# EasyEDA Pro project AceNRFLSMRelease.epro

# Schematic Schematic1_1
Board Name: Board1; Create Date: 2026-01-09; Page Name: P1; Project Name: AceNRFLSM; Schematic Name: Schematic1; Update Date: 2026-01-09; Company: EasyEDA.com; Page Size: A4; Version: V1.0
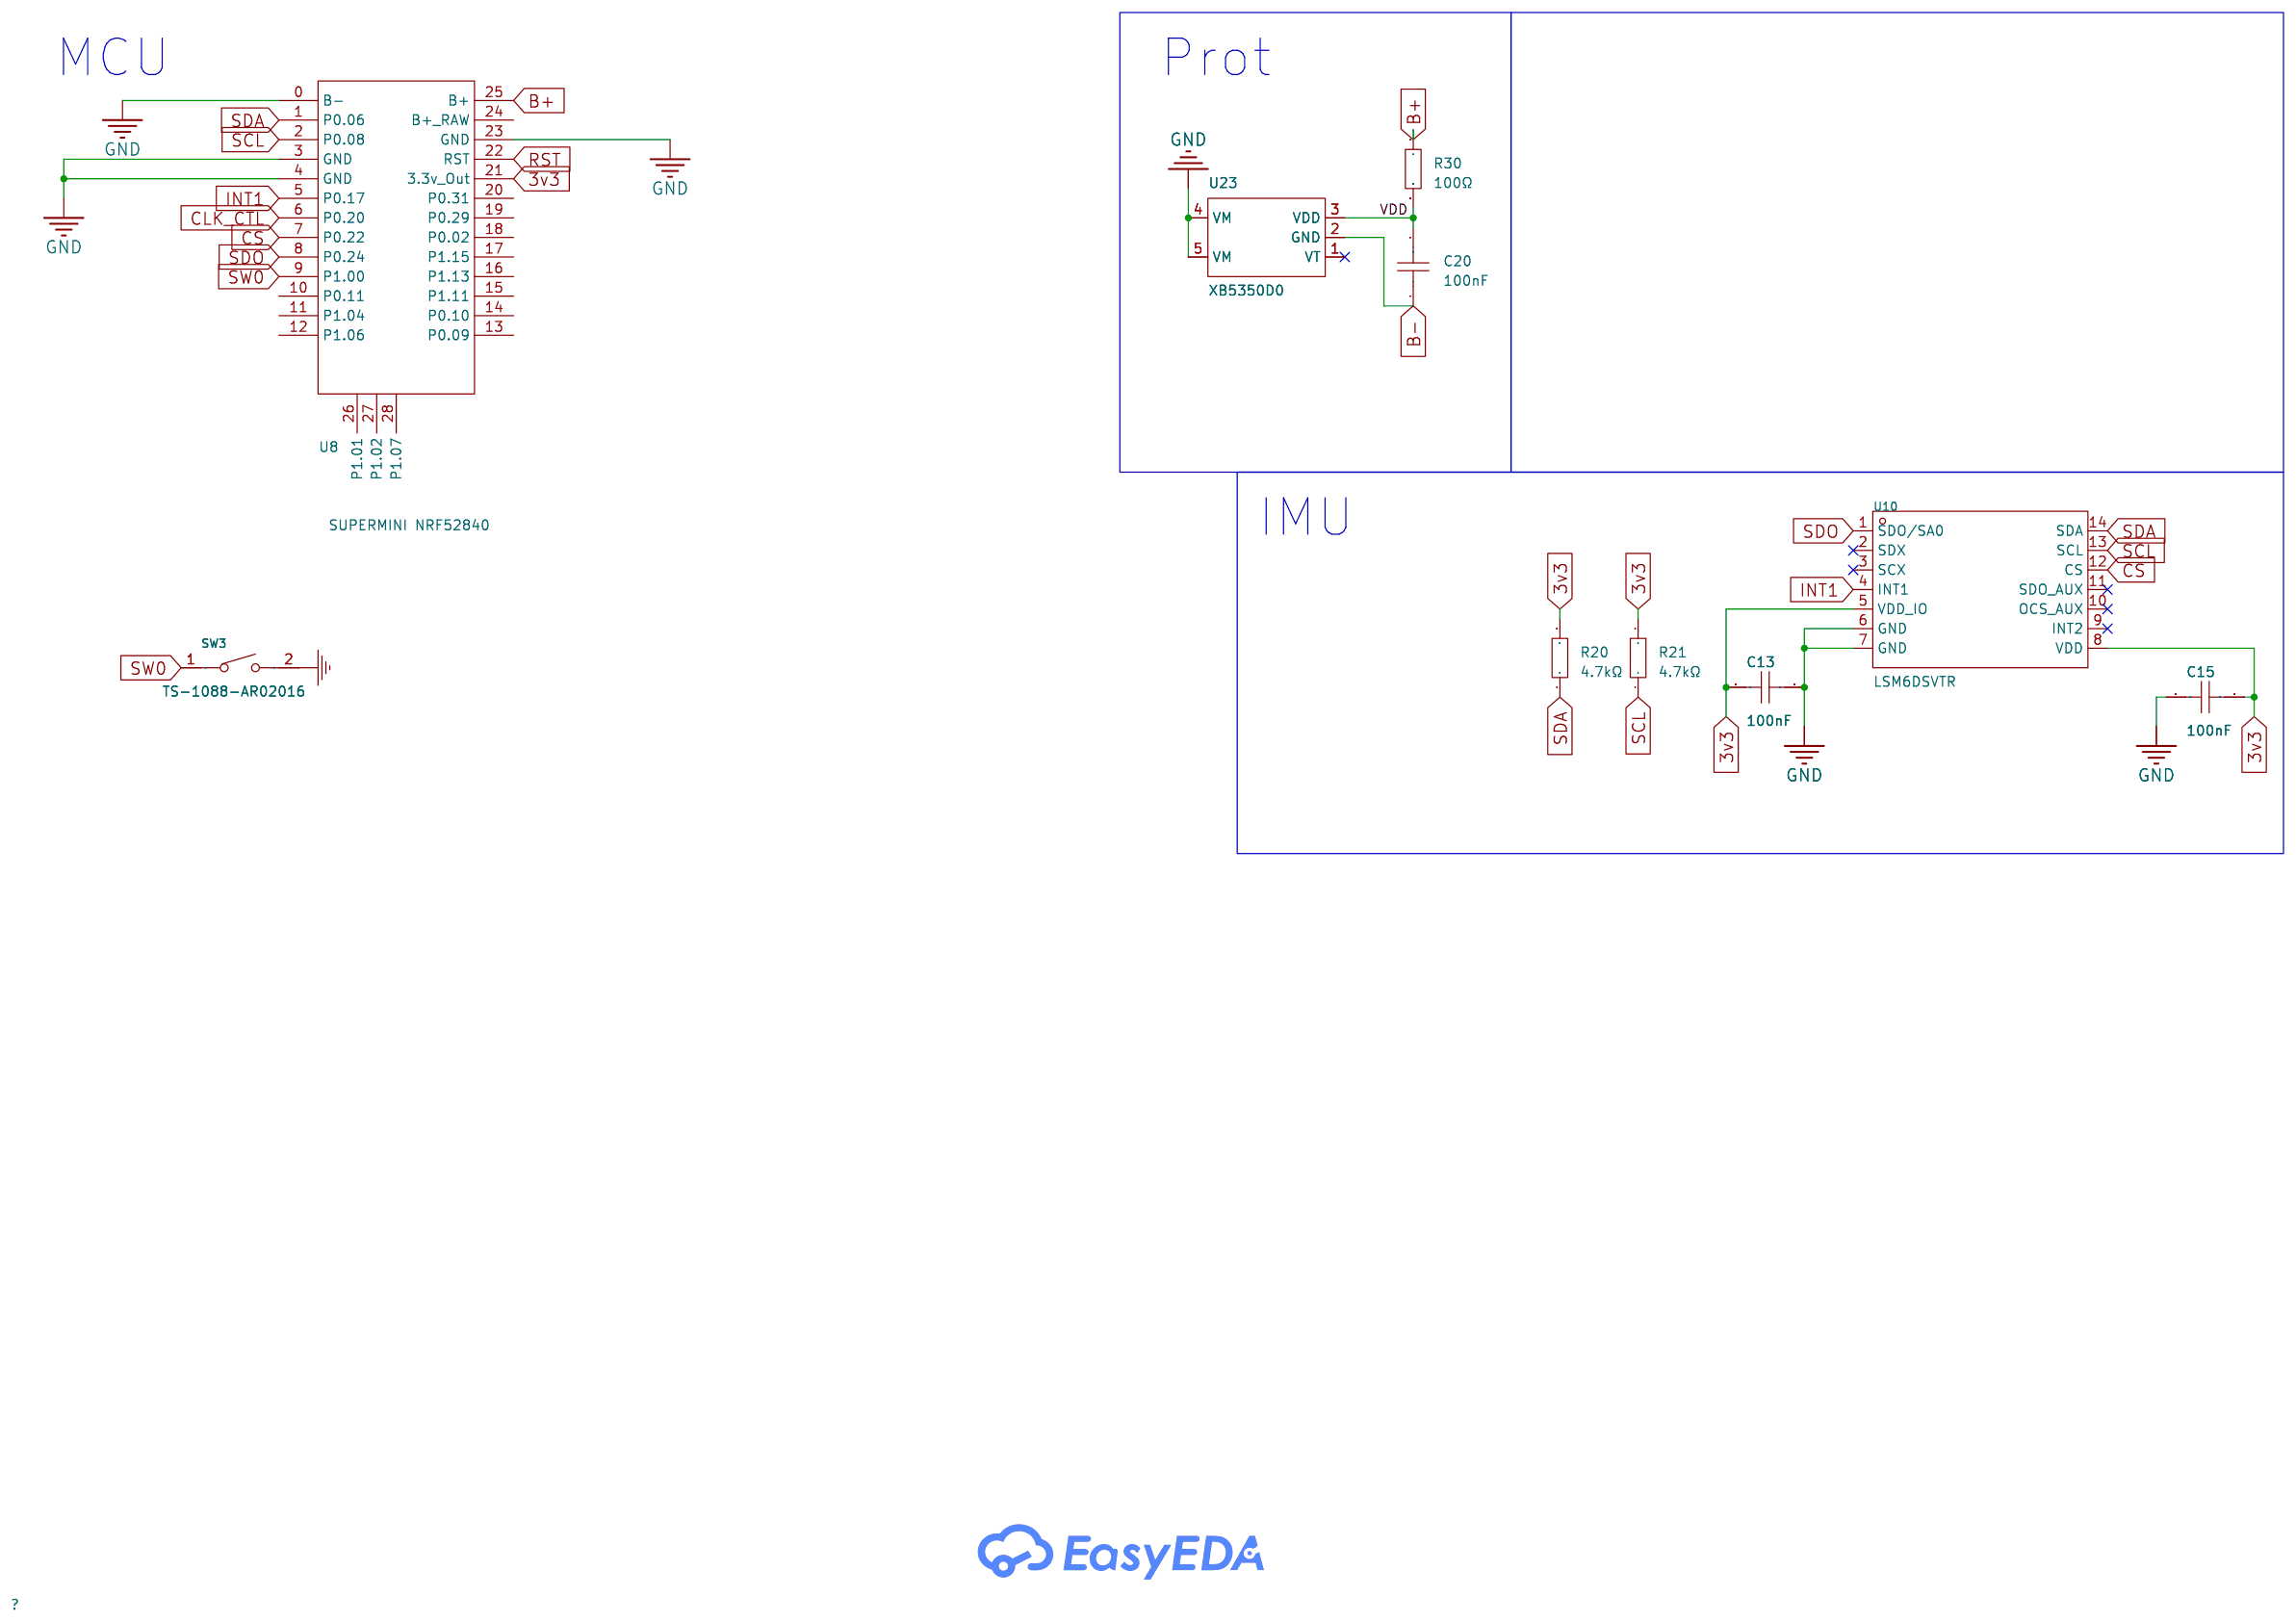
[diagram p0: schematic sheet]

## Parts
C13  100nF  [C0603]
C15  100nF  [C0603]
C20  100nF  [C0603]
R20  4.7kΩ  [R0603]
R21  4.7kΩ  [R0603]
R30  100Ω  [R0603]
SW3  TS-1088-AR02016  [SW-SMD_L3.9-W3.0-P4.45]
U8  SUPERMINI NRF52840  [SuperMini NRF52840]
U10  LSM6DSVTR  [LGA-14_L3.0-W2.5-P0.50-TL]
U23  XB5350D0  [SOT-23-5_L3.0-W1.7-P0.95-LS2.8-BR]

## Library data of the parts
C13 C15 = CC0603KRX7R9BB104: Capacitance: Tolerance:±10% Tolerance:±10% Voltage Rated: Temperature Coefficient:; LCSC Part Name: 100nF ±10% 50V; Supplier Part: C14663; Manufacturer: YAGEO(国巨); Supplier Footprint: 0603; JLCPCB Part Class: Basic Part; Datasheet: https://atta.szlcsc.com/upload/public/pdf/source/20180910/C282072_33301C7F631E79921B82A8DAC6BCC5B3.pdf; Supplier: LCSC; Tolerance: ±10%
C20 = CC0603KRX7R9BB104: Capacitance: Tolerance:±10% Tolerance:±10% Voltage Rated: Temperature Coefficient:; LCSC Part Name: 100nF ±10% 50V; Supplier Part: C14663; Manufacturer: YAGEO(国巨); Supplier Footprint: 0603; JLCPCB Part Class: Basic Part; Datasheet: https://atta.szlcsc.com/upload/public/pdf/source/20180910/C282072_33301C7F631E79921B82A8DAC6BCC5B3.pdf; Supplier: LCSC; Tolerance: ±10%; Check: true
R20 R21 = 0603WAF4701T5E: Type:Thick Film Resistors Resistance:4.7kΩ Tolerance:±1% Tolerance:±1% Power(Watts): Overload Voltage (Max): Temperature Coefficient:±100ppm/℃ Temperature Coefficient:±100ppm/℃ Operating Temperature Range:-55℃~+155℃ Operating Temperature Range:-55℃~+155℃; LCSC Part Name: 4.7kΩ ±1% 100mW 厚膜电阻; Supplier Part: C23162; Manufacturer: UNI-ROYAL(厚声); Supplier Footprint: 0603; JLCPCB Part Class: Basic Part; Datasheet: https://atta.szlcsc.com/upload/public/pdf/source/20200306/C422600_1E6D84923E4A46A82E41ADD87F860B5C.pdf; Supplier: LCSC; Type: Thick Film Resistors; Tolerance: ±1%; Temperature Coefficient: ±100ppm/℃; Operating Temperature Range: -55℃~+155℃
R30 = 0603WAF1000T5E: Type:Thick Film Resistors Resistance: Tolerance:±1% Tolerance:±1% Power(Watts): Overload Voltage (Max): Temperature Coefficient:±200ppm/℃ Temperature Coefficient:±200ppm/℃ Operating Temperature Range:-55℃~+155℃ Operating Temperature Range:-55℃~+155℃; LCSC Part Name: 100Ω ±1% 100mW 厚膜电阻; Supplier Part: C22775; Manufacturer: UNI-ROYAL(厚声); Supplier Footprint: 0603; JLCPCB Part Class: Basic Part; Datasheet: https://atta.szlcsc.com/upload/public/pdf/source/20200306/C422600_1E6D84923E4A46A82E41ADD87F860B5C.pdf; Supplier: LCSC; Type: Thick Film Resistors; Tolerance: ±1%; Temperature Coefficient: ±200ppm/℃; Operating Temperature Range: -55℃~+155℃; Check: true
SW3 = TS-1088-AR02016: Circuit:SPST Actuator Style:Round Button Operating Force:160gf Mounting Style:Brick nogging Switch Length:4mm Switch Width:3mm Switch Height:2mm Strike Gundam:不带 Contact Current:50mA Voltage Rating (DC):12V Insulation Resistance:100MΩ Actuator/Cap Color:B; LCSC Part Name: 4*3*2mm 立贴 轻触开关; Supplier Part: C720477; Manufacturer: XUNPU(讯普); Supplier Footprint: SMD; JLCPCB Part Class: Extended Part; Datasheet: https://atta.szlcsc.com/upload/public/pdf/source/20200810/C720475_60D09DD6C54279ADDB2DC25100F1CC11.pdf; Supplier: LCSC; Circuit: SPST; Actuator Style: Round Button; Operating Force: 160gf; Mounting Style: Brick nogging; Switch Length: 4mm; Switch Width: 3mm; Switch Height: 2mm; Strike Gundam: 不带; Contact Current: 50mA; Voltage Rating (DC): 12V; Insulation Resistance: 100MΩ; Actuator/Cap Color: Black; Pin Style: SMDSplicing; Mechanical Life: 10万次; Operating Temperature: -30℃~+80℃; Check: true
U8 = SUPERMINI NRF52840
U10 = LSM6DSVTR: Sensor Type:Accelerometer Gyroscope Operating Temperature:-40℃~+85℃ Operating Temperature:-40℃~+85℃; Supplier Part: C5267399; Manufacturer: ST(意法半导体); Supplier Footprint: LGA-14(2.5x3); JLCPCB Part Class: Extended Part; Datasheet: https://item.szlcsc.com/datasheet/LSM6DSVTR/5993808.html; Supplier: LCSC; Sensor Type: Accelerometer Gyroscope; Operating Temperature: -40℃~+85℃
U23 = XB5350D0: Supplier Part: C2760002; Manufacturer: xysemi(赛芯微); Supplier Footprint: SOT-23-5; JLCPCB Part Class: Extended Part; Datasheet: https://atta.szlcsc.com/upload/public/pdf/source/20210312/C2760002_95C36489D28D301C5A1FEDA87DDC23DD.pdf; Supplier: LCSC; Check: true

## Nets
3v3: C13.2 C15.1 R20.2 R21.2 U8.21(3.3v Out) U10.5(VDD_IO) U10.8(VDD)
GND: C13.1 C15.2 SW3.2 U8.0(B-) U8.3(GND) U8.4(GND) U8.23(GND) U10.6(GND) U10.7(GND) U23.4(VM) U23.5(VM)
VDD: C20.2 R30.2 U23.3(VDD)
B+: R30.1 U8.25(B+)
B-: C20.1 U23.2(GND)
CLK_CTL: U8.6(P0.20)
CS: U8.7(P0.22) U10.12(CS)
INT1: U8.5(P0.17) U10.4(INT1)
RST: U8.22(RST)
SCL: R21.1 U8.2(P0.08) U10.13(SCL)
SDA: R20.1 U8.1(P0.06) U10.14(SDA)
SDO: U8.8(P0.24) U10.1(SDO/SA0)
SW0: SW3.1 U8.9(P1.00)

Not connected (* = marked no-connect by the designer): U8 10(P0.11) 11(P1.04) 12(P1.06) 13(P0.09) 14(P0.10) 15(P1.11) 16(P1.13) 17(P1.15) 18(P0.02) 19(P0.29) 20(P0.31) 24(B+ RAW) 26(P1.01) 27(P1.02) 28(P1.07); U10 2(SDX)* 3(SCX)* 9(INT2)* 10(OCS_AUX)* 11(SDO_AUX)*; U23 1(VT)*

## Notes on the sheet
- MCU
- Prot
- IMU

# Schematic Schematic1_2
Board Name: Base; Create Date: 2026-01-12; Page Name: P1; Project Name: AceNRFLSM; Schematic Name: Schematic1_2; Update Date: 2026-03-09; Company: EasyEDA.com; Page Size: A4; Version: V1.0
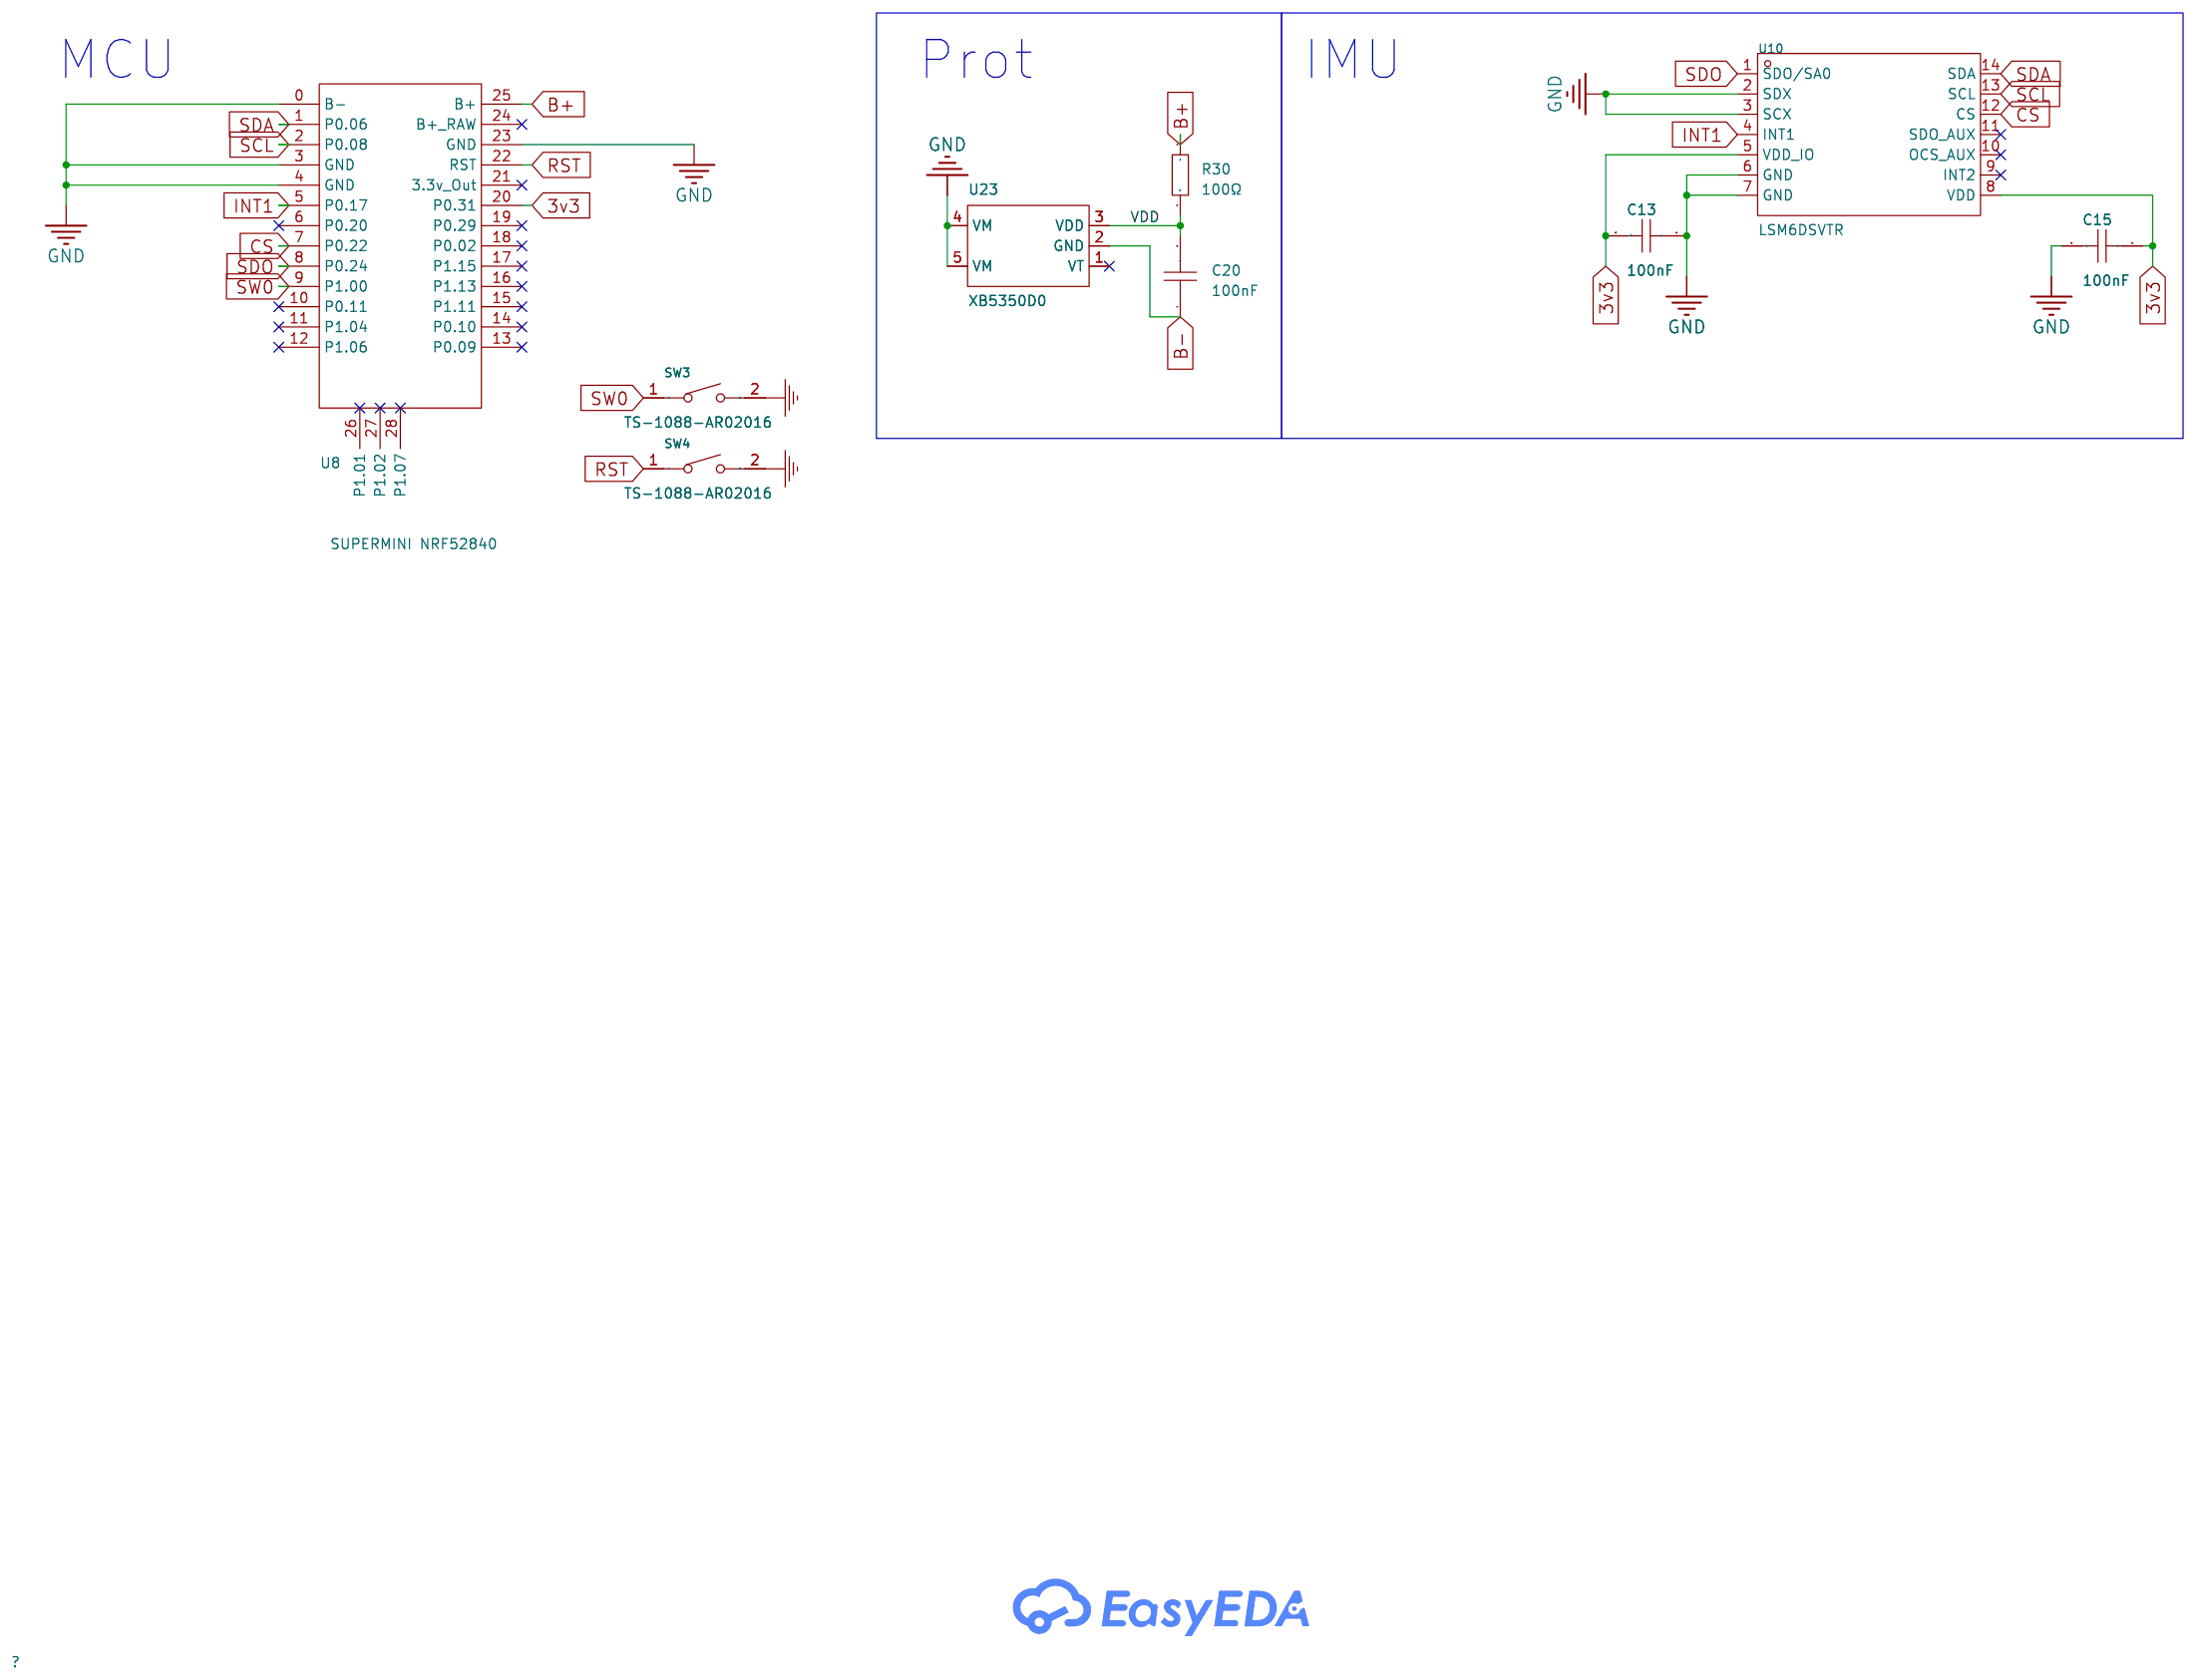
[diagram p1: schematic sheet]

## Parts
C13  100nF  [C0603]
C15  100nF  [C0603]
C20  100nF  [C0603]
R30  100Ω  [R0603]
SW3  TS-1088-AR02016  [SW-SMD_L3.9-W3.0-P4.45]
SW4  TS-1088-AR02016  [SW-SMD_L3.9-W3.0-P4.45]
U8  SUPERMINI NRF52840  [SuperMini NRF52840 Shorty]
U10  LSM6DSVTR  [LGA-14_L3.0-W2.5-P0.50-TL]
U23  XB5350D0  [SOT-23-5_L3.0-W1.7-P0.95-LS2.8-BR]

## Library data of the parts
C13 C15 = CC0603KRX7R9BB104: Capacitance: Tolerance:±10% Tolerance:±10% Voltage Rated: Temperature Coefficient:; LCSC Part Name: 100nF ±10% 50V; Supplier Part: C14663; Manufacturer: YAGEO(国巨); Supplier Footprint: 0603; JLCPCB Part Class: Basic Part; Datasheet: https://atta.szlcsc.com/upload/public/pdf/source/20180910/C282072_33301C7F631E79921B82A8DAC6BCC5B3.pdf; Supplier: LCSC; Tolerance: ±10%
C20 = CC0603KRX7R9BB104: Capacitance: Tolerance:±10% Tolerance:±10% Voltage Rated: Temperature Coefficient:; LCSC Part Name: 100nF ±10% 50V; Supplier Part: C14663; Manufacturer: YAGEO(国巨); Supplier Footprint: 0603; JLCPCB Part Class: Basic Part; Datasheet: https://atta.szlcsc.com/upload/public/pdf/source/20180910/C282072_33301C7F631E79921B82A8DAC6BCC5B3.pdf; Supplier: LCSC; Tolerance: ±10%; Check: true
R30 = 0603WAF1000T5E: Type:Thick Film Resistors Resistance: Tolerance:±1% Tolerance:±1% Power(Watts): Overload Voltage (Max): Temperature Coefficient:±200ppm/℃ Temperature Coefficient:±200ppm/℃ Operating Temperature Range:-55℃~+155℃ Operating Temperature Range:-55℃~+155℃; LCSC Part Name: 100Ω ±1% 100mW 厚膜电阻; Supplier Part: C22775; Manufacturer: UNI-ROYAL(厚声); Supplier Footprint: 0603; JLCPCB Part Class: Basic Part; Datasheet: https://atta.szlcsc.com/upload/public/pdf/source/20200306/C422600_1E6D84923E4A46A82E41ADD87F860B5C.pdf; Supplier: LCSC; Type: Thick Film Resistors; Tolerance: ±1%; Temperature Coefficient: ±200ppm/℃; Operating Temperature Range: -55℃~+155℃; Check: true
SW3 SW4 = TS-1088-AR02016: Circuit:SPST Actuator Style:Round Button Operating Force:160gf Mounting Style:Brick nogging Switch Length:4mm Switch Width:3mm Switch Height:2mm Strike Gundam:不带 Contact Current:50mA Voltage Rating (DC):12V Insulation Resistance:100MΩ Actuator/Cap Color:B; LCSC Part Name: 4*3*2mm 立贴 轻触开关; Supplier Part: C720477; Manufacturer: XUNPU(讯普); Supplier Footprint: SMD; JLCPCB Part Class: Extended Part; Datasheet: https://atta.szlcsc.com/upload/public/pdf/source/20200810/C720475_60D09DD6C54279ADDB2DC25100F1CC11.pdf; Supplier: LCSC; Circuit: SPST; Actuator Style: Round Button; Operating Force: 160gf; Mounting Style: Brick nogging; Switch Length: 4mm; Switch Width: 3mm; Switch Height: 2mm; Strike Gundam: 不带; Contact Current: 50mA; Voltage Rating (DC): 12V; Insulation Resistance: 100MΩ; Actuator/Cap Color: Black; Pin Style: SMDSplicing; Mechanical Life: 10万次; Operating Temperature: -30℃~+80℃; Check: true
U8 = SUPERMINI NRF52840
U10 = LSM6DSVTR: Sensor Type:Accelerometer Gyroscope Operating Temperature:-40℃~+85℃ Operating Temperature:-40℃~+85℃; Supplier Part: C5267399; Manufacturer: ST(意法半导体); Supplier Footprint: LGA-14(2.5x3); JLCPCB Part Class: Extended Part; Datasheet: https://item.szlcsc.com/datasheet/LSM6DSVTR/5993808.html; Supplier: LCSC; Sensor Type: Accelerometer Gyroscope; Operating Temperature: -40℃~+85℃
U23 = XB5350D0: Supplier Part: C2760002; Manufacturer: xysemi(赛芯微); Supplier Footprint: SOT-23-5; JLCPCB Part Class: Extended Part; Datasheet: https://atta.szlcsc.com/upload/public/pdf/source/20210312/C2760002_95C36489D28D301C5A1FEDA87DDC23DD.pdf; Supplier: LCSC; Check: true

## Nets
3v3: C13.2 C15.1 U8.20(P0.31) U10.5(VDD_IO) U10.8(VDD)
GND: C13.1 C15.2 SW3.2 SW4.2 U8.0(B-) U8.3(GND) U8.4(GND) U8.23(GND) U10.2(SDX) U10.3(SCX) U10.6(GND) U10.7(GND) U23.4(VM) U23.5(VM)
VDD: C20.2 R30.2 U23.3(VDD)
B+: R30.1 U8.25(B+)
B-: C20.1 U23.2(GND)
CS: U8.7(P0.22) U10.12(CS)
INT1: U8.5(P0.17) U10.4(INT1)
RST: SW4.1 U8.22(RST)
SCL: U8.2(P0.08) U10.13(SCL)
SDA: U8.1(P0.06) U10.14(SDA)
SDO: U8.8(P0.24) U10.1(SDO/SA0)
SW0: SW3.1 U8.9(P1.00)

Not connected (* = marked no-connect by the designer): U8 6(P0.20)* 10(P0.11)* 11(P1.04)* 12(P1.06)* 13(P0.09)* 14(P0.10)* 15(P1.11)* 16(P1.13)* 17(P1.15)* 18(P0.02)* 19(P0.29)* 21(3.3v Out)* 24(B+ RAW)* 26(P1.01)* 27(P1.02)* 28(P1.07)*; U10 9(INT2)* 10(OCS_AUX)* 11(SDO_AUX)*; U23 1(VT)*

## Notes on the sheet
- MCU
- Prot
- IMU

# Board PCB1_2
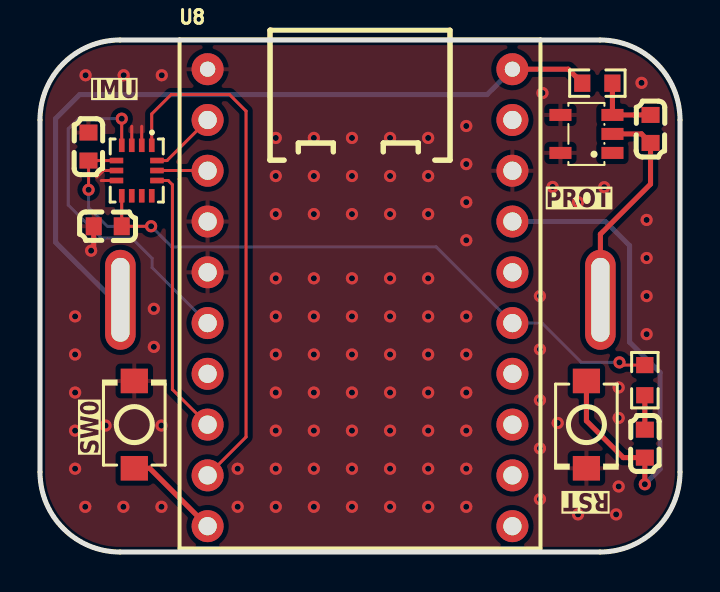
[diagram p2: board, top side]
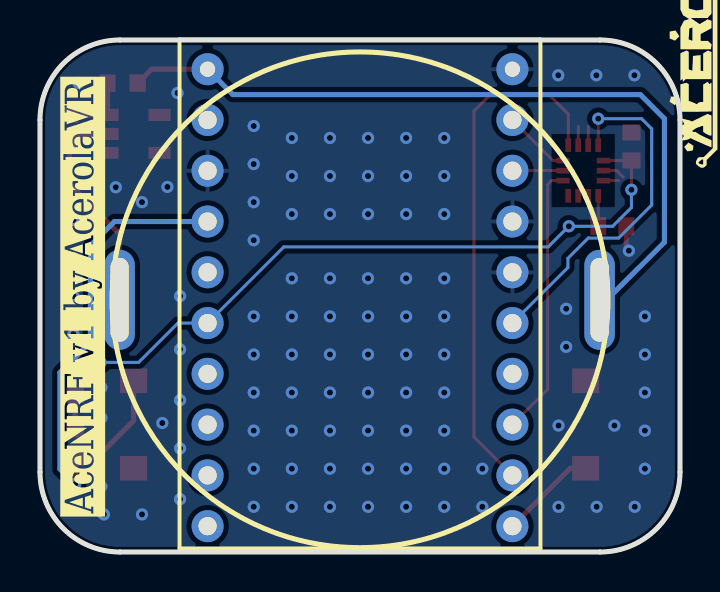
[diagram p3: board, bottom side, seen from below]

Outline 32 x 25.62 mm; copper layers: Top Layer, Bottom Layer. Coordinates in mm from the lower left corner of the outline.
Outline path: 0,21.62 0,4 arc(1.17,1.17) 4,0 28,0 arc(30.83,1.17) 32,4 32,21.62 arc(30.83,24.45) 28,25.62 4,25.62 arc(1.17,24.45) 0,21.62
Stack: Top Layer 0.035mm / Dielectric1 1.11mm FR4 er 4.5 / Bottom Layer 0.035mm

## Design rules (mm)
template: JLCPCB Capability(Two Layers Board)
spacing copperThickness1oz (default): track to track 0.102, other pairs 0.152 to 0.3
spacing copperThickness2oz: track to track 0.203, other pairs 0.152 to 0.3
track width copperThickness1oz (default): min 0.127, default 0.254, max 2.54
track width copperThickness2oz: min 0.203, default 0.254, max 2.54
differential pair differentialPair (default): width min 0.127, default 0.254, max 2.54; gap min 0.152, default 0.152
via viaSize (default): diameter min 0.5, default 0.61, max 10; hole min 0.3, default 0.305, max 6.3

## Placement (name value [footprint] x y rotation side)
C13  100nF  [C0603]  3.39 16.3 0 top
C15  100nF  [C0603]  2.42 20.29 90 top
C20  100nF  [C0603]  30.53 21.17 90 top
C21  100nF  [C0603]  30.24 5.42 270 top
NOREF  -  [Pad_e101]  28.02 12.62 180 top
NOREF#2  -  [Pad_e102]  4.02 12.62 180 top
R30  100Ω  [R0603]  27.87 23.46 0 top
R31  10k  [R0603]  30.24 8.6 90 top
SW3  TS-1088-AR02016  [SW-SMD_L3.9-W3.0-P4.45]  4.71 6.37 90 top
SW4  TS-1088-AR02016  [SW-SMD_L3.9-W3.0-P4.45]  27.32 6.37 270 top
U8  SUPERMINI NRF52840  [SuperMini NRF52840 Shorty]  8.38 24.15 0 top
U10  LSM6DSVTR  [LGA-14_L3.0-W2.5-P0.50-TL]  4.84 19.09 270 top
U23  XB5350D0  [SOT-23-5_L3.0-W1.7-P0.95-LS2.8-BR]  27.32 20.92 0 top

## Footprints (pads in the part's own frame, mm; a bottom-side part is the same pattern mirrored in y, then rotated)
C0603
  rect 0.8x0.9 smd: 1(-0.7,0) 2(0.7,0)
LGA-14_L3.0-W2.5-P0.50-TL
  rect 0.675x0.28 smd: 1(-1.262,0.75) 2(-1.262,0.25) 3(-1.262,-0.25) 4(-1.262,-0.75) 8(1.262,-0.75) 9(1.262,-0.25) 10(1.262,0.25) 11(1.262,0.75)
  rect 0.28x0.675 smd: 5(-0.5,-1.012) 6(0,-1.012) 7(0.5,-1.012) 12(0.5,1.012) 13(0,1.012) 14(-0.5,1.012)
Pad_e101
  oval 1.524x5 hole 0.914x4.2: 1(0,0)
Pad_e102
  oval 1.524x5 hole 0.914x4.2: 2(0,0)
R0603
  rect 0.806x0.864 smd: 1(-0.753,0) 2(0.753,0)
SOT-23-5_L3.0-W1.7-P0.95-LS2.8-BR
  rect 1.1x0.6 smd: 1(1.3,-0.95) 2(1.3,0) 3(1.3,0.95) 4(-1.3,0.95) 5(-1.3,-0.95)
SuperMini NRF52840 Shorty
  round 1.6 hole 0.762: 0(0,0) 25(15.24,0)
  round 1.6 hole 0.914: 1(0,-2.54) 2(0,-5.08) 3(0,-7.62) 4(0,-10.16) 5(0,-12.7) 6(0,-15.24) 7(0,-17.78) 8(0,-20.32) 9(0,-22.86) 16(15.24,-22.86) 17(15.24,-20.32) 18(15.24,-17.78) 19(15.24,-15.24) 20(15.24,-12.7) 21(15.24,-10.16) 22(15.24,-7.62) 23(15.24,-5.08) 24(15.24,-2.54)
SW-SMD_L3.9-W3.0-P4.45
  rect 1.23x1.36 smd: 1(-2.185,0) 2(2.185,0)

## Nets
3V3: C13.2 C15.1 R31.2 U8.20 U10.5 U10.8
GND: C13.1 C15.2 SW3.2 SW4.2 U8.0 U8.3 U8.4 U8.23 U10.2 U10.3 U10.6 U10.7 U23.4 U23.5
VDD: C20.2 R30.2 U23.3
B+: NOREF#2.2 R30.1 U8.25
B-: C20.1 NOREF.1 U23.2
CS: U8.7 U10.12
INT1: U8.5 U10.4
RST: C21.2 SW4.1 U8.22
SCL: U8.2 U10.13
SDA: U8.1 U10.14
SDO: U8.8 U10.1
SW0: SW3.1 U8.9
$1N4661: C21.1 R31.1

Pads without a net: U8 6 16 17 18 19 21 24; U10 9 10 11; U23 1

## Via types
v1: diameter 0.61, hole 0.305, Top Layer to Bottom Layer, 103 vias

## Routing (per net, layer and track width the routed paths; a pad name or vN(x,y) marks a point on that pad's centre or on a via; arc(x,y) is an arc through that point)
3V3: length 37.8
  Top Layer w0.15: U10.8 C13.2 v1(5.56,16.3) ; v1(2.43,18.12) 2.43,19.58 C15.1 U10.5 ; R31.2 29.11,9.35 v1(28.97,9.49)
  Bottom Layer w0.15: v1(28.97,9.49) 27.07,9.49 25.1,11.45 U8.20 19.81,15.26 6.59,15.26 v1(5.56,16.3) 3.37,16.3 2.43,17.23 v1(2.43,18.12)
GND: length 5.1
  Top Layer w0.15: U10.6 3.17,19.09 2.84,18.76 ; U10.7 3.06,18.59 ; U10.2 5.09,21.3 ; 4.59,20.35 4.59,21.3
  Top Layer w0.254: v1(2.56,15.08) 2.69,15.21 C13.1
  vias: v1(1.75,11.79) v1(1.75,9.88) v1(1.75,7.98) v1(1.75,6.07) v1(1.75,4.17) v1(2.28,23.85) v1(2.26,2.26) v1(3.28,6.33) v1(4.18,23.85) v1(4.17,2.26) v1(5.69,12.17) v1(5.69,10.26) v1(6.09,23.85) v1(6.07,6.33) v1(6.07,2.26) v1(9.88,4.17) v1(9.88,2.26) v1(11.79,20.72) v1(11.79,18.81) v1(11.79,16.91) v1(11.79,13.69) v1(11.79,11.79) v1(11.79,9.88) v1(11.79,7.98) v1(11.79,6.07) v1(11.79,4.17) v1(11.79,2.26) v1(13.69,20.72) v1(13.69,18.81) v1(13.69,16.91) v1(13.69,13.69) v1(13.69,11.79) v1(13.69,9.88) v1(13.69,7.98) v1(13.69,6.07) v1(13.69,4.17) v1(13.69,2.26) v1(15.6,20.72) v1(15.6,18.81) v1(15.6,16.91) v1(15.6,13.69) v1(15.6,11.79) v1(15.6,9.88) v1(15.6,7.98) v1(15.6,6.07) v1(15.6,4.17) v1(15.6,2.26) v1(17.5,20.72) v1(17.5,18.81) v1(17.5,16.91) v1(17.5,13.69) v1(17.5,11.79) v1(17.5,9.88) v1(17.5,7.98) v1(17.5,6.07) v1(17.5,4.17) v1(17.5,2.26) v1(19.41,20.72) v1(19.41,18.81) v1(19.41,16.91) v1(19.41,13.69) v1(19.41,11.79) v1(19.41,9.88) v1(19.41,7.98) v1(19.41,6.07) v1(19.41,4.17) v1(19.41,2.26) v1(21.31,21.31) v1(21.31,19.41) v1(21.31,17.5) v1(21.31,15.6) v1(21.31,11.79) v1(21.31,9.88) v1(21.31,7.98) v1(21.31,6.07) v1(21.31,4.17) v1(21.31,2.26) v1(25,12.8) v1(25,10.14) v1(25,7.6) v1(25,5.18) v1(25,2.64) v1(25.12,22.96) v1(25.63,18.27) v1(25.88,6.45) v1(26.9,17.5) v1(26.9,1.88) v1(28.21,18.25) v1(28.81,1.88) v1(28.93,8.23) v1(28.93,6.71) v1(28.93,3.28) v1(30.08,23.47) v1(30.33,16.61) v1(30.33,14.71) v1(30.33,12.8) v1(30.33,10.9)
VDD: length 3.5
  Top Layer w0.254: R30.2 U23.3 C20.2
B+: length 38.3
  Top Layer w0.254: R30.1 26.42,24.15 U8.25
  Bottom Layer w0.254: NOREF#2.2 3.66,12.62 0.78,15.5 0.78,21.68 1.98,22.88 22.35,22.88 U8.25
B-: length 11
  Top Layer w0.254: NOREF.1 28.02,15.9 30.53,18.41 C20.1 30.08,20.92 U23.2
CS: length 13.6
  Top Layer w0.15: U10.12 6.41,18.59 6.62,18.38 6.62,8.13 U8.7
INT1: length 17.7
  Top Layer w0.15: U10.4 v1(4.09,21.68)
  Bottom Layer w0.15: U8.5 5.6,14.23 5.6,14.69 4.59,15.71 3.06,15.71 1.41,17.36 1.41,21.17 1.92,21.68 v1(4.09,21.68)
RST: length 26.3
  Top Layer w0.254: v1(30.24,3.39) C21.2 29.16,4.72 27.32,6.57 SW4.1
  Bottom Layer w0.254: v1(30.24,3.39) 31,4.15 31,8.98 29.48,10.5 29.48,15.33 28.27,16.53 U8.22
SCL: length 2.5
  Top Layer w0.15: U8.2 8.37,19.09 U10.13
SDA: length 3.4
  Top Layer w0.15: U8.1 6.35,19.59 U10.14
SDO: length 26
  Top Layer w0.15: U10.1 5.59,21.92 6.56,22.88 9.48,22.88 10.3,22.06 10.3,5.76 U8.8
SW0: length 4.9
  Top Layer w0.254: U8.9 5.48,4.19 SW3.1
$1N4661: length 1.7
  Top Layer w0.254: R31.1 C21.1

## Copper pours and planes (outline as drawn; the poured copper is in the pictures)
GND on Top Layer: -0.87,25.62 33.04,25.62 33.04,-23.41 -0.87,-23.41
GND on Bottom Layer: -0.87,27.65 33.04,27.65 33.04,-21.25 -0.87,-21.25

## Text on the board
Bottom Silkscreen Layer: AceNRF v1 by AcerolaVR
Top Silkscreen Layer: IMU | SW0 | PROT | RST

# Board PCB1_1
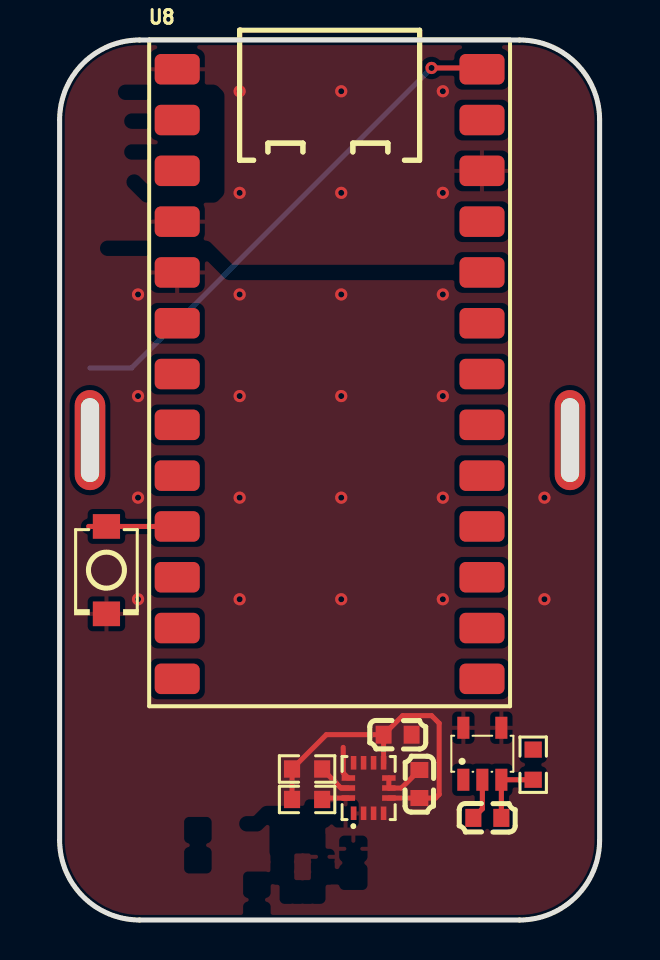
[diagram p4: board, top side]
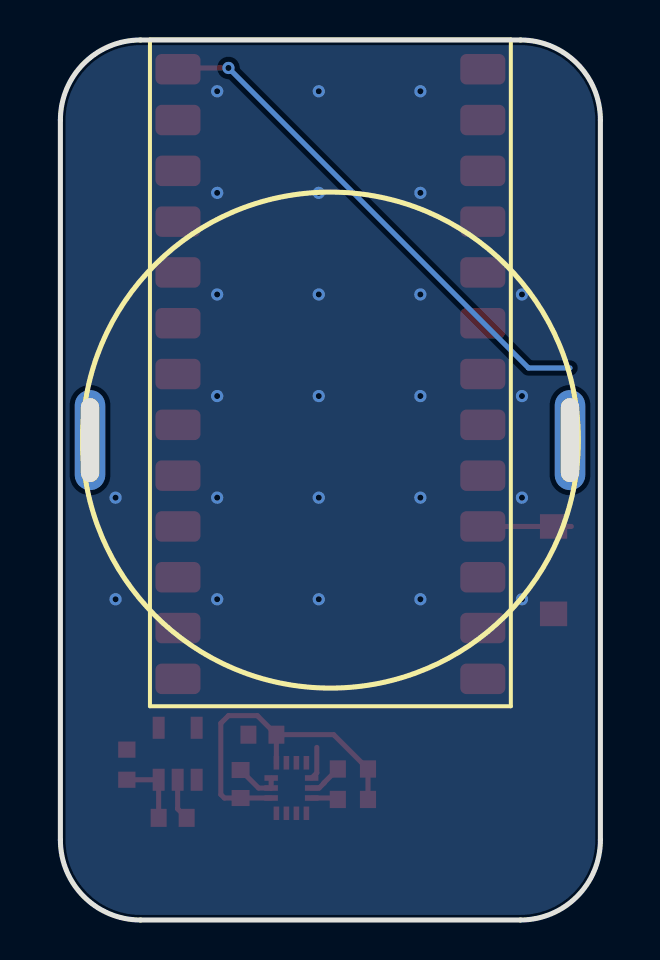
[diagram p5: board, bottom side, seen from below]

Outline 27 x 44 mm; copper layers: Top Layer, Bottom Layer. Coordinates in mm from the lower left corner of the outline.
Outline path: 0,40 0,4 arc(1.17,1.17) 4,0 23,0 arc(25.83,1.17) 27,4 27,40 arc(25.83,42.83) 23,44 4,44 arc(1.17,42.83) 0,40
Stack: Top Layer 0.035mm / Dielectric1 1.51mm FR4 er 4.5 / Bottom Layer 0.035mm

## Design rules (mm)
template: JLCPCB Capability(Two Layers Board)
spacing copperThickness1oz (default): track to track 0.102, other pairs 0.152 to 0.3
spacing copperThickness2oz: track to track 0.203, other pairs 0.152 to 0.3
track width copperThickness1oz (default): min 0.127, default 0.254, max 2.54
track width copperThickness2oz: min 0.203, default 0.254, max 2.54
differential pair differentialPair (default): width min 0.127, default 0.254, max 2.54; gap min 0.152, default 0.152
via viaSize (default): diameter min 0.5, default 0.61, max 10; hole min 0.3, default 0.305, max 6.3

## Placement (name value [footprint] x y rotation side)
C13  100nF  [C0603]  16.9 9.27 180 top
C15  100nF  [C0603]  17.99 6.8 90 top
C20  100nF  [C0603]  21.39 5.11 0 top
NOREF  -  [Pad_e101]  25.52 23.99 180 top
NOREF#2  -  [Pad_e102]  1.52 23.99 180 top
R20  4.7kΩ  [R0603]  12.37 6.03 180 top
R21  4.7kΩ  [R0603]  12.37 7.55 180 top
R30  100Ω  [R0603]  23.68 7.77 270 top
SW3  TS-1088-AR02016  [SW-SMD_L3.9-W3.0-P4.45]  2.34 17.49 270 top
U8  SUPERMINI NRF52840  [SuperMini NRF52840]  5.88 42.54 0 top
U10  LSM6DSVTR  [LGA-14_L3.0-W2.5-P0.50-TL]  15.45 6.6 90 top
U23  XB5350D0  [SOT-23-5_L3.0-W1.7-P0.95-LS2.8-BR]  21.14 8.31 270 top

## Footprints (pads in the part's own frame, mm; a bottom-side part is the same pattern mirrored in y, then rotated)
C0603
  rect 0.8x0.9 smd: 1(-0.7,0) 2(0.7,0)
LGA-14_L3.0-W2.5-P0.50-TL
  rect 0.675x0.28 smd: 1(-1.262,0.75) 2(-1.262,0.25) 3(-1.262,-0.25) 4(-1.262,-0.75) 8(1.262,-0.75) 9(1.262,-0.25) 10(1.262,0.25) 11(1.262,0.75)
  rect 0.28x0.675 smd: 5(-0.5,-1.012) 6(0,-1.012) 7(0.5,-1.012) 12(0.5,1.012) 13(0,1.012) 14(-0.5,1.012)
Pad_e101
  oval 1.524x5 hole 0.914x4.2: 1(0,0)
Pad_e102
  oval 1.524x5 hole 0.914x4.2: 2(0,0)
R0603
  rect 0.806x0.864 smd: 1(-0.753,0) 2(0.753,0)
SOT-23-5_L3.0-W1.7-P0.95-LS2.8-BR
  rect 1.1x0.6 smd: 1(1.3,-0.95) 2(1.3,0) 3(1.3,0.95) 4(-1.3,0.95) 5(-1.3,-0.95)
SuperMini NRF52840
  rrect 2.25x1.524 smd: 0(0,0) 1(0,-2.54) 2(0,-5.08) 3(0,-7.62) 4(0,-10.16) 5(0,-12.7) 6(0,-15.24) 7(0,-17.78) 8(0,-20.32) 9(0,-22.86) 10(0,-25.4) 11(0,-27.94) 12(0,-30.48) 13(15.24,-30.48) 14(15.24,-27.94) 15(15.24,-25.4) 16(15.24,-22.86) 17(15.24,-20.32) 18(15.24,-17.78) 19(15.24,-15.24) 20(15.24,-12.7) 21(15.24,-10.16) 22(15.24,-7.62) 23(15.24,-5.08) 24(15.24,-2.54) 25(15.24,0)
SW-SMD_L3.9-W3.0-P4.45
  rect 1.23x1.36 smd: 1(-2.185,0) 2(2.185,0)

## Nets
3V3: C13.2 C15.1 R20.2 R21.2 U8.21 U10.5 U10.8
GND: C13.1 C15.2 SW3.2 U8.0 U8.3 U8.4 U8.23 U10.6 U10.7 U23.4 U23.5
VDD: C20.2 R30.2 U23.3
B+: NOREF#2.2 R30.1 U8.25
B-: C20.1 NOREF.1 U23.2
CLK_CTL: U8.6
CS: U8.7 U10.12
INT1: U8.5 U10.4
RST: U8.22
SCL: R21.1 U8.2 U10.13
SDA: R20.1 U8.1 U10.14
SDO: U8.8 U10.1
SW0: SW3.1 U8.9

Pads without a net: U8 10 11 12 13 14 15 16 17 18 19 20 24; U10 2 3 9 10 11; U23 1

## Via types
v1: diameter 0.61, hole 0.305, Top Layer to Bottom Layer, 25 vias

## Routing (per net, layer and track width the routed paths; a pad name or vN(x,y) marks a point on that pad's centre or on a via; arc(x,y) is an arc through that point)
3V3: length 17.7
  Top Layer w0.254: C13.2 17.15,10.22 18.6,10.22 18.98,9.84 18.98,6.28 18.8,6.1 C15.1 U10.5 ; C13.2 13.34,9.27 R21.2 R20.2 ; C13.2 U10.8
GND: length 2.4
  Top Layer w0.254: C15.2 17.09,6.6 U10.6 U10.7
  vias: v1(3.92,31.28) v1(3.92,26.2) v1(3.92,21.12) v1(3.92,16.04) v1(9,41.44) v1(9,36.36) v1(9,31.28) v1(9,26.2) v1(9,21.12) v1(9,16.04) v1(14.08,41.44) v1(14.08,36.36) v1(14.08,31.28) v1(14.08,26.2) v1(14.08,21.12) v1(14.08,16.04) v1(19.16,41.44) v1(19.16,36.36) v1(19.16,31.28) v1(19.16,26.2) v1(19.16,21.12) v1(19.16,16.04) v1(24.24,21.12) v1(24.24,16.04)
VDD: length 3.5
  Top Layer w0.254: R30.2 U23.3 C20.2
B+: length 25.8
  Top Layer w0.254: U8.25 21.06,42.6 v1(18.6,42.6)
  Bottom Layer w0.254: 1.52,27.6 3.6,27.6 v1(18.6,42.6)
B-: length 2.1
  Top Layer w0.254: C20.1 21.14,5.56 U23.2
CS: length 1.6
  Top Layer w0.254: 14.18,8.63 14.18,7.36 U10.12
SCL: length 1.7
  Top Layer w0.254: R21.1 13.82,6.86 13.82,6.84 14.06,6.6 U10.13
SDA: length 1.3
  Top Layer w0.254: R20.1 13.2,6.1 U10.14
SW0: length 4.4
  Top Layer w0.254: 1.45,19.68 SW3.1 U8.9

## Copper pours and planes (outline as drawn; the poured copper is in the pictures)
GND on Top Layer: -3.37,44 30.54,44 30.54,-5.02 -3.37,-5.02
GND on Bottom Layer: -3.37,44 30.54,44 30.54,-4.9 -3.37,-4.9
